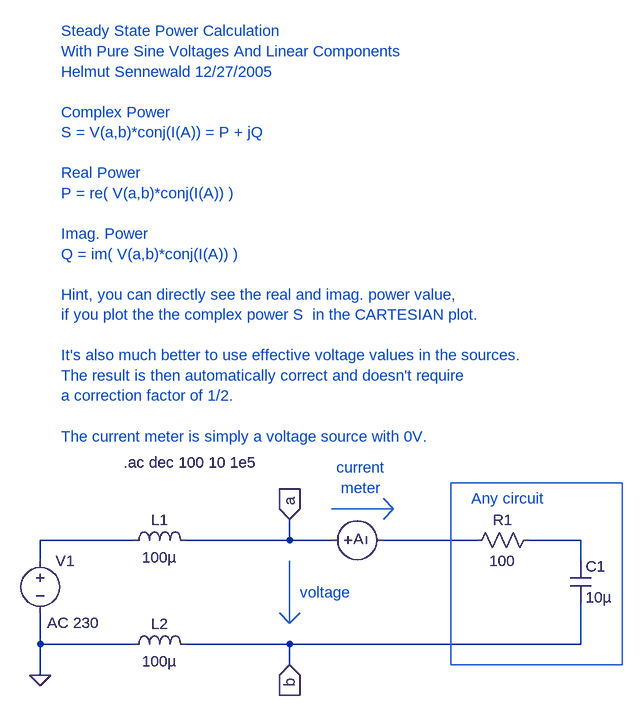
[diagram p0: schematic complex_power1.asc]
complex_power1.asc, the LTspice schematic file:
Version 4
SHEET 1 880 680
WIRE -384 160 -384 128
WIRE -384 288 -384 240
WIRE -384 336 -384 288
WIRE -240 128 -384 128
WIRE -240 288 -384 288
WIRE 0 128 -160 128
WIRE 0 128 0 96
WIRE 0 288 -160 288
WIRE 0 320 0 288
WIRE 64 128 0 128
WIRE 288 128 144 128
WIRE 448 128 368 128
WIRE 448 160 448 128
WIRE 448 288 0 288
WIRE 448 288 448 224
FLAG -384 336 0
FLAG 0 96 a
IOPIN 0 96 In
FLAG 0 320 b
IOPIN 0 320 In
SYMBOL voltage -384 144 R0
WINDOW 123 11 111 Left 0
WINDOW 39 0 0 Left 0
SYMATTR Value2 AC 230
SYMATTR InstName V1
SYMATTR Value ""
SYMBOL cap 432 160 R0
SYMATTR InstName C1
SYMATTR Value 10µ
SYMBOL res 272 144 R270
WINDOW 0 32 56 VTop 0
WINDOW 3 0 56 VBottom 0
SYMATTR InstName R1
SYMATTR Value 100
SYMBOL voltage 48 128 R270
WINDOW 0 2 50 VRight 0
WINDOW 3 -10 50 Invisible 0
SYMATTR InstName A
SYMATTR Value 0
SYMBOL ind -256 144 R270
WINDOW 0 32 56 VTop 0
WINDOW 3 5 56 VBottom 0
SYMATTR InstName L1
SYMATTR Value 100µ
SYMBOL ind -256 304 R270
WINDOW 0 32 56 VTop 0
WINDOW 3 5 56 VBottom 0
SYMATTR InstName L2
SYMATTR Value 100µ
TEXT -256 8 Left 0 !.ac dec 100 10 1e5
TEXT 280 64 Left 0 ;Any circuit
TEXT -352 -656 Left 0 ;Steady State Power Calculation \nWith Pure Sine Voltages And Linear Components\nHelmut Sennewald 12/27/2005\n \nComplex Power\nS = V(a,b)*conj(I(A)) = P + jQ\n \nReal Power \nP = re( V(a,b)*conj(I(A)) )\n \nImag. Power\nQ = im( V(a,b)*conj(I(A)) )\n \nHint, you can directly see the real and imag. power value,\nif you plot the the complex power S  in the CARTESIAN plot.\n \nIt's also much better to use effective voltage values in the sources.\nThe result is then automatically correct and doesn't require \na correction factor of 1/2.\n \nThe current meter is simply a voltage source with 0V.
TEXT 72 16 Left 0 ;current\n meter
TEXT 16 208 Left 0 ;voltage
LINE Normal 160 80 64 80
LINE Normal 144 64 160 80
LINE Normal 144 96 160 80
LINE Normal 0 256 0 160
LINE Normal 16 240 0 256
LINE Normal -16 240 0 256
RECTANGLE Normal 512 320 248 40

The netlist it stands for:
* complex_power1.asc
V1 N001 0 AC 230
C1 N003 b 10µ
R1 N002 N003 100
V§A a N002 0
L1 N001 a 100µ
L2 0 b 100µ
.ac dec 100 10 1e5
* Any circuit
* Steady State Power Calculation
* With Pure Sine Voltages And Linear Components
* Helmut Sennewald 12/27/2005
* Complex Power
* S = V(a,b)*conj(I(A)) = P + jQ
* Real Power
* P = re( V(a,b)*conj(I(A)) )
* Imag. Power
* Q = im( V(a,b)*conj(I(A)) )
* Hint, you can directly see the real and imag. power value,
* if you plot the the complex power S  in the CARTESIAN plot.
* It's also much better to use effective voltage values in the sources.
* The result is then automatically correct and doesn't require
* a correction factor of 1/2.
* The current meter is simply a voltage source with 0V.
* current
*  meter
* voltage
.backanno
.end